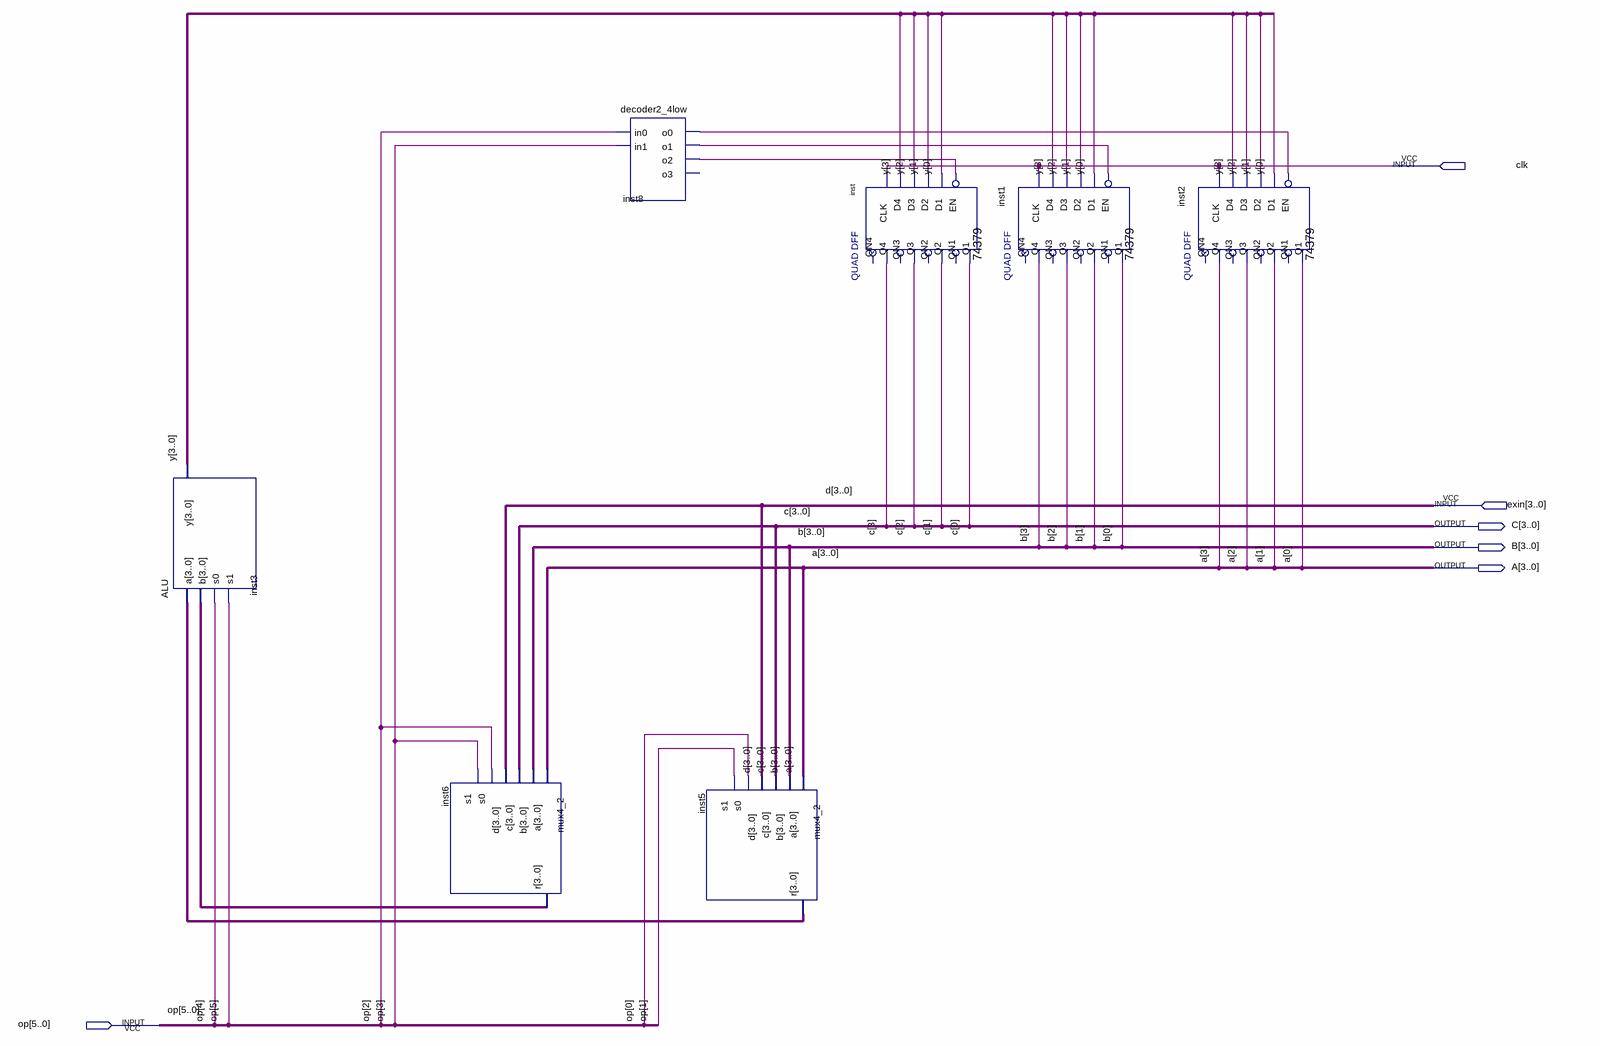
[diagram p0: schematic sheet]
// Quartus schematic proce.bdf as structural Verilog: 7 symbols, 6 pins
module proce (
  input  clk,
  input  [3:0] exin,
  input  [5:0] op,
  output [3:0] C,
  output [3:0] B,
  output [3:0] A
);

  wire inst8_o0, inst8_o1, inst8_o2;
  wire [3:0] inst5_r, inst6_r, y;

  ALU inst3 (.a(inst5_r), .b(inst6_r), .s0(op[4]), .s1(op[5]), .y(y));
  mux4_2 inst6 (.a(A), .b(B), .c(C), .d(exin), .s0(op[2]), .s1(op[3]), .r(inst6_r));
  decoder2_4low inst8 (.in0(op[2]), .in1(op[3]), .o0(inst8_o0), .o1(inst8_o1), .o2(inst8_o2));  // open: o3
  mux4_2 inst5 (.a(A), .b(B), .c(C), .d(exin), .s0(op[0]), .s1(op[1]), .r(inst5_r));
  \74379  inst (
    .D1(y[0]), .EN(inst8_o2), .D2(y[1]), .D3(y[2]), .CLK(clk), .D4(y[3]), .Q4(C[3]), .Q3(C[2]), .Q2(C[1]),
    .Q1(C[0]));  // open: QN4, QN2, QN3, QN1
  \74379  inst1 (
    .D1(y[0]), .EN(inst8_o1), .D2(y[1]), .D3(y[2]), .CLK(clk), .D4(y[3]), .Q4(B[3]), .Q3(B[2]), .Q2(B[1]),
    .Q1(B[0]));  // open: QN4, QN2, QN3, QN1
  \74379  inst2 (
    .D1(y[0]), .EN(inst8_o0), .D2(y[1]), .D3(y[2]), .CLK(clk), .D4(y[3]), .Q4(A[3]), .Q3(A[2]), .Q2(A[1]),
    .Q1(A[0]));  // open: QN4, QN2, QN3, QN1

  // Other names for the same wires on the sheet: d[3:0] = exin
endmodule
